# Altium schematic sheet Part L.SchDoc
size A4; SheetNumber: 7; SheetTotal: 16
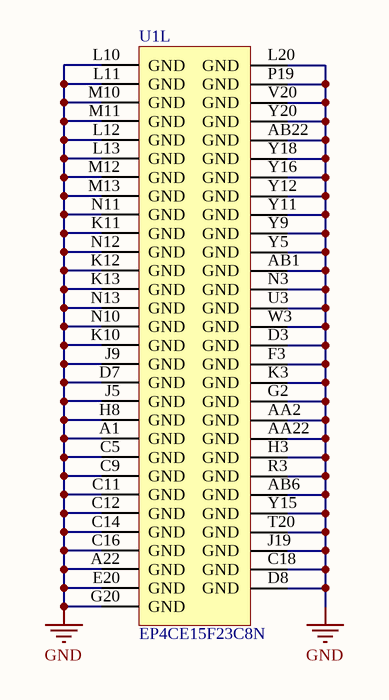
[diagram p0: Part L.SchDoc]

## Parts
U1  EP4CE15F23C8N  [FBGA484_A-240]  (part L of 13)

## Nets
GND: U1.A1(GND) U1.A22(GND) U1.AA2(GND) U1.AA22(GND) U1.AB1(GND) U1.AB6(GND) U1.AB22(GND) U1.C5(GND) U1.C9(GND) U1.C11(GND) U1.C12(GND) U1.C14(GND) U1.C16(GND) U1.C18(GND) U1.D3(GND) U1.D7(GND) U1.D8(GND) U1.E20(GND) U1.F3(GND) U1.G2(GND) U1.G20(GND) U1.H3(GND) U1.H8(GND) U1.J5(GND) U1.J9(GND) U1.J19(GND) U1.K3(GND) U1.K10(GND) U1.K11(GND) U1.K12(GND) U1.K13(GND) U1.L10(GND) U1.L11(GND) U1.L12(GND) U1.L13(GND) U1.L20(GND) U1.M10(GND) U1.M11(GND) U1.M12(GND) U1.M13(GND) U1.N3(GND) U1.N10(GND) U1.N11(GND) U1.N12(GND) U1.N13(GND) U1.P19(GND) U1.R3(GND) U1.T20(GND) U1.U3(GND) U1.V20(GND) U1.W3(GND) U1.Y5(GND) U1.Y9(GND) U1.Y11(GND) U1.Y12(GND) U1.Y15(GND) U1.Y16(GND) U1.Y18(GND) U1.Y20(GND)

## Library data of the parts
U1 = FPGA_EP4CE15F23C8N: Cyclone IV Family FPGA, 1.2V Core, 343 I/O Pins, 4 PLLs, 484-Pin FBGA, Speed Grade 8, Commercial Grade, Pb-Free; Manufacturer: Altera; PackageVersion: ver1.0, Jun-2011; PackageReference: FBGA484_A-240; ComponentLink3URL: http://www.altera.com/literature/lit-dp.jsp?category=cyc%204&showspreadsheet=y; ComponentLink1Description: Manufacturer URL; DatasheetVersion: ver1.6, Nov-2011; ComponentLink3Description: Pinout; ComponentLink2URL: http://www.altera.com/literature/hb/cyclone-iv/cyclone4-handbook.pdf; ComponentLink1URL: http://www.altera.com/; ComponentLink2Description: Handbook; PackageDescription: 484-Pin FineLine Ball Grid Array (FBGA) - Wire Bond - A:2.40; Code_JEDEC: MS-034-AAJ-1; ComponentLink4URL: http://www.altera.com/devicepackaging/04R00247-02.pdf; ComponentLink4Description: Package Specification